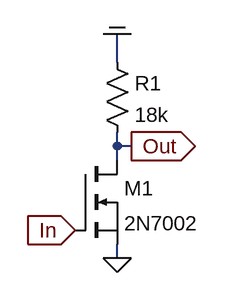
[diagram p0: schematic nm_not.asc]
nm_not.asc, the LTspice schematic file:
Version 4
SHEET 1 880 680
WIRE 224 32 224 0
WIRE 224 128 224 112
WIRE 240 128 224 128
WIRE 224 144 224 128
WIRE 224 256 224 240
FLAG 224 256 0
FLAG 176 224 In
IOPIN 176 224 In
FLAG 240 128 Out
IOPIN 240 128 Out
FLAG 224 0 COM
SYMBOL nmos 176 144 R0
SYMATTR InstName M1
SYMATTR Value 2N7002
SYMBOL res 208 16 R0
SYMATTR InstName R1
SYMATTR Value 18k

The netlist it stands for:
* nm_not.asc
M1 Out In 0 0 2N7002
R1 COM Out 18k
.model NMOS NMOS
.model PMOS PMOS
.lib standard.mos
.backanno
.end